# EAGLE design schema (EAGLE 6.5.0)
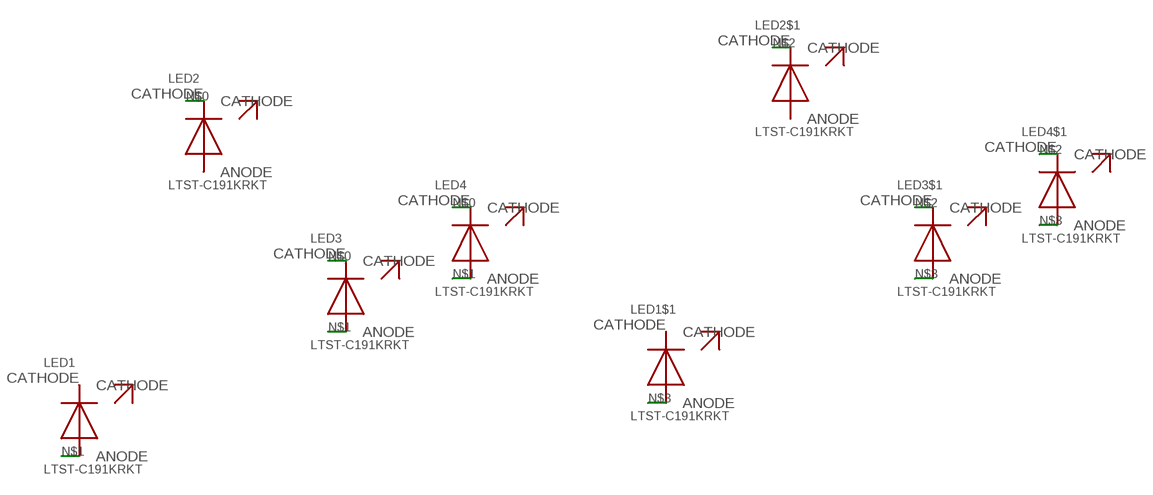
[diagram p0: schematic, sheet 1]

## Parts
LED1  LTST-C191KRKT  LED  [LED]
LED1$1  LTST-C191KRKT  LED  [LED]
LED2  LTST-C191KRKT  LED  [LED]
LED2$1  LTST-C191KRKT  LED  [LED]
LED3  LTST-C191KRKT  LED  [LED]
LED3$1  LTST-C191KRKT  LED  [LED]
LED4  LTST-C191KRKT  LED  [LED]
LED4$1  LTST-C191KRKT  LED  [LED]

## Nets
N$0: LED2.CATHODE LED3.CATHODE LED4.CATHODE
N$1: LED1.ANODE LED3.ANODE LED4.ANODE
N$2: LED2$1.CATHODE LED3$1.CATHODE LED4$1.CATHODE
N$3: LED1$1.ANODE LED3$1.ANODE LED4$1.ANODE
Unconnected: LED1$1.CATHODE LED1.CATHODE LED2$1.ANODE LED2.ANODE

## Library data of the parts
LED1 LED1$1 LED2 LED2$1 LED3 LED3$1 LED4 LED4$1 = Andres_Project:LED

## Board
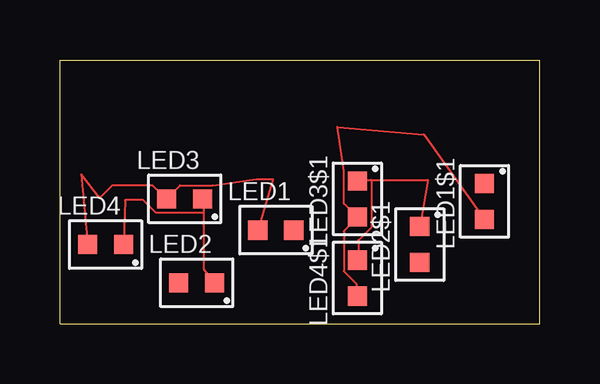
[diagram p1: board, top side]

Size 20 x 11 mm. Coordinates in mm from the lower left corner, seen from the top.
Outline: 0,0 20,0 20,11 0,11 0,0
Copper layers (1*16): Top 0.035mm / dielectric 0.75mm / Bottom 0.035mm
Design rules "default": minimum track width 3mil, minimum drill 5mil, track to track 3mil, track to pad 3mil, pad to pad 3mil, via to via 3mil, smd to smd 0mil, copper to edge 5mil, drill to drill 8mil, minimum pad ring 5mil, minimum via ring 2.5mil, stop-mask expansion 4mil, vias tented up to drill 0mil, thermal gap 10mil

### Footprints (pad centres in the part's own frame; a part is rotated, then mirrored left to right if it is on the bottom)
LED = smd 0.8 x 0.8: ANODE -0.75,0; CATHODE 0.75,0

### Placement (x,y rotation side)
LED1  9,3.9 0 top
LED1$1  17.7,5.1 90 top
LED2  5.7,1.7 0 top
LED2$1  15,3.3 90 top
LED3  5.2,5.2 0 top
LED3$1  12.4,5.2 90 top
LED4  1.9,3.3 0 top
LED4$1  12.4,1.9 90 top

### Tracks (layer width: path | path; a pad name or v marks a point on that pad's centre or on a via)
N$0
  Top 0.076: 5.99,4.62 5.99,5.15 LED3.CATHODE | 5.99,4.62 5.99,2.26 LED2.CATHODE | 5.99,4.62 4.01,4.62 3.48,5.15 2.71,5.15 LED4.CATHODE
N$1
  Top 0.076: LED4.ANODE 0.89,6.23 1.65,5.23 2.18,5.76 3.86,5.76 4.39,5.23 LED3.ANODE 4.47,5.23 5,5.76 6.37,5.76 8.21,6.03 8.89,6.03 LED1.ANODE
N$2
  Top 0.076: 12.98,5.99 12.45,5.99 LED3$1.CATHODE | 12.98,5.99 15.34,5.99 LED2$1.CATHODE | 12.98,5.99 12.98,4.01 12.45,3.48 12.45,2.71 LED4$1.CATHODE
N$3
  Top 0.076: LED4$1.ANODE 12.37,1.19 12.37,1.65 11.84,2.18 11.84,3.86 12.37,4.39 LED3$1.ANODE 12.37,4.47 11.84,5 11.84,6.37 11.57,8.21 15.17,7.89 LED1$1.ANODE